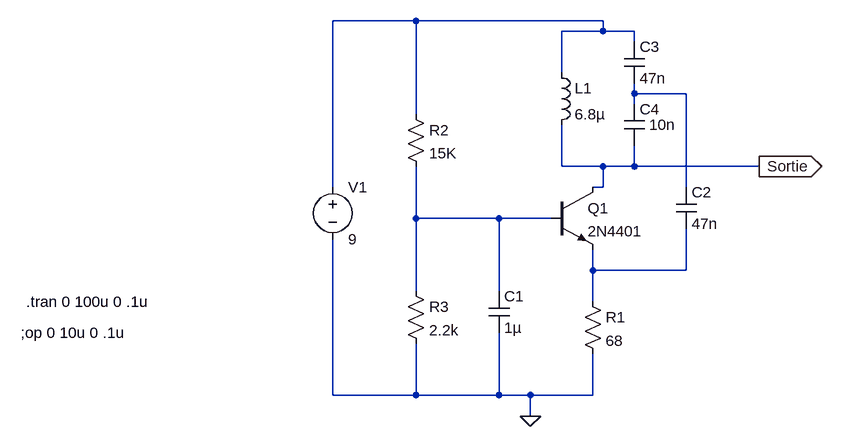
[diagram p0: schematic Colpitts_Osc.asc]
Colpitts_Osc.asc, the LTspice schematic file:
Version 4
SHEET 1 1020 680
WIRE -32 -112 -160 -112
WIRE 256 -112 -32 -112
WIRE 256 -96 256 -112
WIRE 256 -96 192 -96
WIRE 304 -96 256 -96
WIRE 304 -80 304 -96
WIRE 192 -32 192 -96
WIRE 304 0 304 -16
WIRE 384 0 304 0
WIRE 304 16 304 0
WIRE -32 32 -32 -112
WIRE 192 112 192 48
WIRE 256 112 192 112
WIRE 304 112 304 80
WIRE 304 112 256 112
WIRE 496 112 304 112
WIRE -160 144 -160 -112
WIRE 256 144 256 112
WIRE 256 144 240 144
WIRE 384 144 384 0
WIRE -32 192 -32 112
WIRE 96 192 -32 192
WIRE 176 192 96 192
WIRE 240 272 240 240
WIRE 384 272 384 208
WIRE 384 272 240 272
WIRE -32 304 -32 192
WIRE 96 304 96 192
WIRE 240 320 240 272
WIRE -160 464 -160 224
WIRE -32 464 -32 384
WIRE -32 464 -160 464
WIRE 96 464 96 368
WIRE 96 464 -32 464
WIRE 144 464 96 464
WIRE 240 464 240 400
WIRE 240 464 144 464
WIRE 144 496 144 464
FLAG 496 112 Sortie
IOPIN 496 112 Out
FLAG 144 496 0
SYMBOL npn 176 144 R0
SYMATTR InstName Q1
SYMATTR Value 2N4401
SYMBOL res 224 304 R0
SYMATTR InstName R1
SYMATTR Value 68
SYMBOL res -48 16 R0
SYMATTR InstName R2
SYMATTR Value 15K
SYMBOL res -48 288 R0
SYMATTR InstName R3
SYMATTR Value 2.2k
SYMBOL cap 80 304 R0
SYMATTR InstName C1
SYMATTR Value 1µ
SYMBOL cap 368 144 R0
SYMATTR InstName C2
SYMATTR Value 47n
SYMBOL cap 288 -80 R0
SYMATTR InstName C3
SYMATTR Value 47n
SYMBOL cap 288 16 R0
WINDOW 3 39 32 Left 2
SYMATTR Value 10n
SYMATTR InstName C4
SYMBOL ind 176 -48 R0
SYMATTR InstName L1
SYMATTR Value 6.8µ
SYMATTR SpiceLine Rser=0
SYMBOL voltage -160 128 R0
WINDOW 123 0 0 Left 2
WINDOW 39 0 0 Left 2
SYMATTR InstName V1
SYMATTR Value 9
TEXT -632 320 Left 2 !.tran 0 100u 0 .1u
TEXT -640 368 Left 2 !;op 0 10u 0 .1u

The netlist it stands for:
* Colpitts_Osc.asc
Q1 Sortie N003 N004 0 2N4401
R1 N004 0 68
R2 N001 N003 15K
R3 N003 0 2.2k
C1 N003 0 1µ
C2 N002 N004 47n
C3 N001 N002 47n
C4 N002 Sortie 10n
L1 N001 Sortie 6.8µ Rser=0
V1 N001 0 9
.model NPN NPN
.model PNP PNP
.lib standard.bjt
.tran 0 100u 0 .1u
;op 0 10u 0 .1u
.backanno
.end